# EAGLE design 5v dcreg (EAGLE 9.6.2)
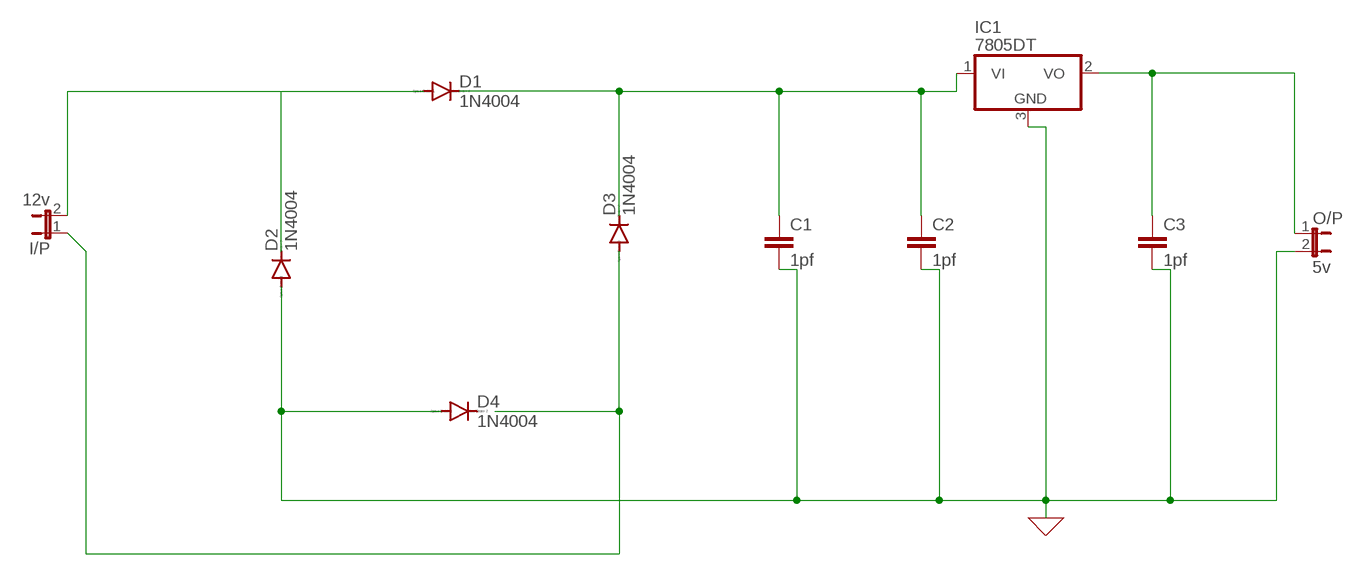
[diagram p0: schematic, sheet 1]

## Parts
C1  1pf  C2,5-3  [C2.5-3]
C2  1pf  C2,5-3  [C2.5-3]
C3  1pf  C2,5-3  [C2.5-3]
D1  1N4004  [DO41-10]
D2  1N4004  [DO41-10]
D3  1N4004  [DO41-10]
D4  1N4004  [DO41-10]
I/P  12v  JP1E  [JP1]
IC1  7805DT  [TO252]
O/P  5v  JP1E  [JP1]

## Nets
0: C1.2 C2.2 C3.2 D2.A D4.A IC1.3(GND) O/P.2 ; supply symbol labelled GND
N$1: D1.A D2.C I/P.2
N$2: C1.1 C2.1 D1.C D3.C IC1.1(VI)
N$4: D3.A I/P.1
N$5: C3.1 IC1.2(VO) O/P.1
Unconnected: D4.C

## Library data of the parts
C1-C3 = capacitor-wima:C: CAPACITOR naming: grid - package width
D1-D4 = diode:1N4004: DIODE general purpose rectifier, 1 A
I/P O/P = jumper:JP1E: JUMPER
IC1 = linear:78*: Positive VOLTAGE REGULATOR Source: http://cache.national.com/ds/LM/LM78L05.pdf http://www.fairchildsemi.com/ds/LM/LM7805.pdf

## Board
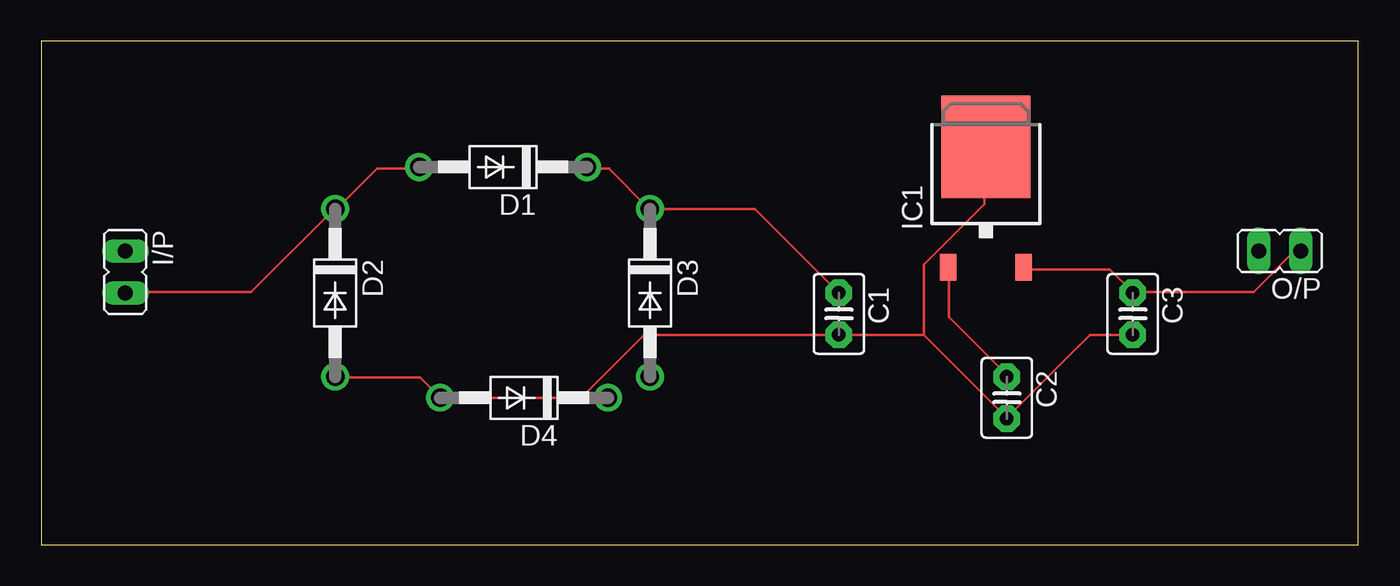
[diagram p1: board, top side]
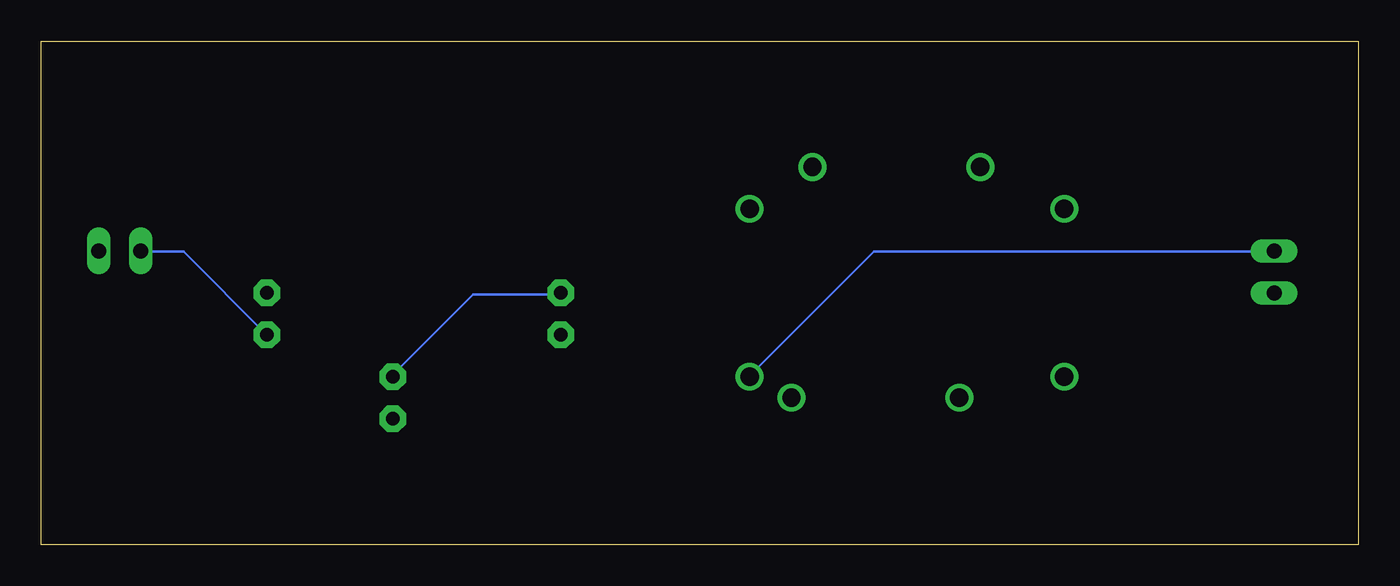
[diagram p2: board, bottom side, seen from below]

Size 79.68 x 30.47 mm. Coordinates in mm from the lower left corner, seen from the top.
Outline: 0,0 79.68,0 79.68,30.47 0,30.47 0,0
Copper layers (1*16): Top 0.035mm / dielectric 1.5mm / Bottom 0.035mm
Design rules "default": minimum track width 6mil, minimum drill 0.35mm, track to track 6mil, track to pad 6mil, pad to pad 6mil, via to via 6mil, smd to smd 6mil, copper to edge 40mil, drill to drill 6mil, minimum pad ring 10mil, minimum via ring 8mil, stop-mask expansion 4mil, vias tented up to drill 0mil, thermal gap 10mil

### Footprints (pad centres in the part's own frame; a part is rotated, then mirrored left to right if it is on the bottom)
C2.5-3 = drill 0.813 pad 1.6 octagon: 1 -1.27,0; 2 1.27,0
DO41-10 = drill 1.118: A 5.08,0; C -5.08,0
JP1 = drill 0.914 long: 1 0,-1.27; 2 0,1.27
TO252 = smd 1 x 1.6: 1 -2.28,-4.8; 2 2.28,-4.8 | smd 5.4 x 6.2: 3 0,2.5

### Placement (x,y rotation side)
C1  48.26,13.97 270 top
C2  58.42,8.89 270 top
C3  66.04,13.97 270 top
D1  27.94,22.86 180 top
D2  17.78,15.24 270 top
D3  36.83,15.24 270 top
D4  29.21,8.89 180 top
I/P  5.08,16.51 180 top
IC1  57.15,21.59 0 top
O/P  74.93,17.78 90 top

### Tracks (layer width: path | path; a pad name or v marks a point on that pad's centre or on a via)
0
  Top 0.152: D2.A 17.88,10.11 22.91,10.11 D4.A 32.66,8.89 36.47,12.7 C1.2 53.39,12.7 | 58.42,7.67 53.39,12.7 | 53.39,12.7 53.39,16.97 57.05,20.62 57.05,23.98 IC1.3 | C3.2 63.45,12.7 58.42,7.67 | 58.42,7.67 C2.2
  Bottom 0.152: C3.2 71.07,17.73 73.66,17.73 O/P.2
N$1
  Top 0.152: I/P.2 5.08,15.29 12.7,15.29 17.73,20.32 D2.C 17.88,20.32 20.32,22.76 22.76,22.76 D1.A
N$2
  Top 0.152: D1.C 33.12,22.76 34.34,22.76 36.78,20.32 D3.C 43.18,20.32 C1.1 | IC1.1 54.91,16.66 54.91,13.77 58.42,10.26 C2.1
  Bottom 0.152: C1.1 48.36,15.14 53.54,15.14 58.42,10.26 C2.1
N$4
  Bottom 0.152: I/P.1 5.08,17.73 29.31,17.73 36.78,10.26 D3.A
N$5
  Top 0.152: 66.04,15.29 64.67,16.66 59.49,16.66 IC1.2 | 66.04,15.29 73.36,15.29 75.79,17.73 76.1,17.73 O/P.1 | 66.04,15.29 C3.1